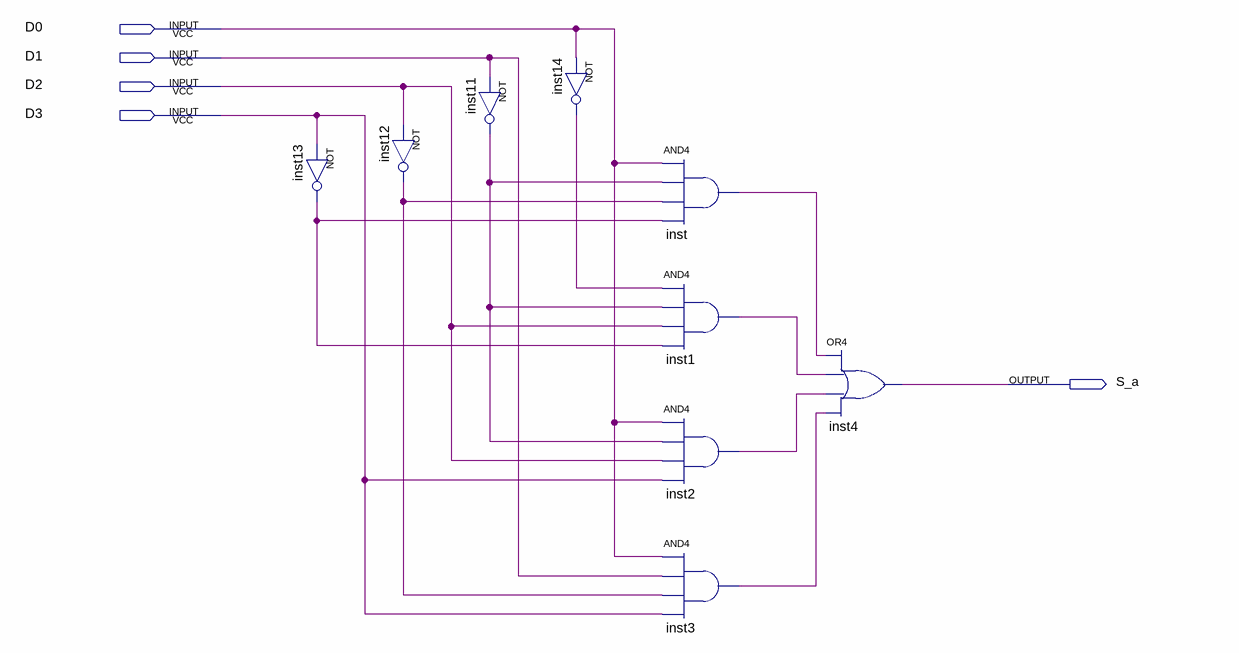
[diagram p0: schematic sheet]
// Quartus schematic S_a.bdf as structural Verilog: 9 symbols, 5 pins
module S_a (
  input  D0,
  input  D1,
  input  D2,
  input  D3,
  output S_a
);

  wire inst1_out, inst2_out, inst3_out, inst11_out, inst12_out, inst13_out, inst14_out, inst_out;

  not inst13 (inst13_out, D3);
  not inst12 (inst12_out, D2);
  not inst11 (inst11_out, D1);
  not inst14 (inst14_out, D0);
  and inst (inst_out, D0, inst11_out, inst12_out, inst13_out);
  and inst1 (inst1_out, inst14_out, inst11_out, D2, inst13_out);
  and inst2 (inst2_out, D0, inst11_out, D2, D3);
  and inst3 (inst3_out, D0, D1, inst12_out, D3);
  or inst4 (S_a, inst_out, inst1_out, inst2_out, inst3_out);
endmodule
